# Altium schematic sheet VCO_BFP420.SchDoc: Voltage Controlled Oscillator
size A4; Author: Alemla; Revision: 1.2; SheetNumber: 3; SheetTotal: 7; SPICEModelCacheUMHTQHEF: <root> / <DocumentId>UMHTQHEF</DocumentId> / </root>
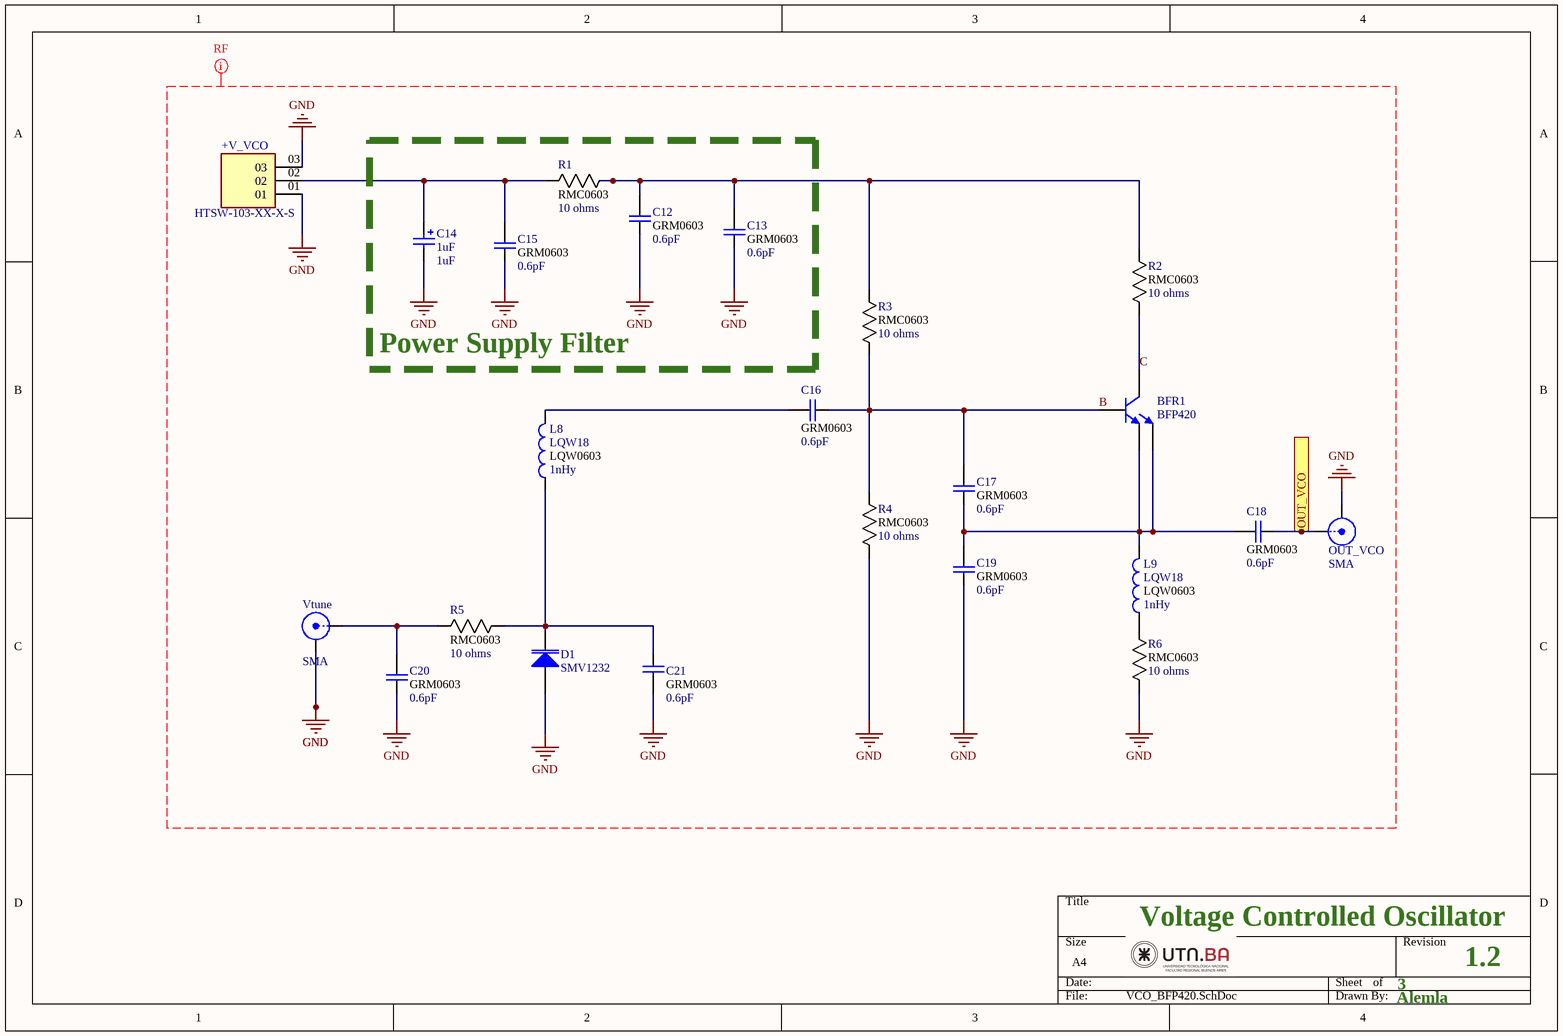
[diagram p0: VCO_BFP420.SchDoc]

## Parts
+V_VCO  HTSW-103-XX-X-S  [SAMTEC_HTSW-103-XX-X-S]
BFR1  BFP420  [SOT-343_N]
C12  value 0.6pF  footprint: GRM0603  [CAPC1608X90N]  (hidden comment: Cap 0603)
C13  value 0.6pF  footprint: GRM0603  [CAPC1608X90N]  (hidden comment: Cap 0603)
C14  1uF  [6-0805_N]
C15  value 0.6pF  footprint: GRM0603  [CAPC1608X90N]  (hidden comment: Cap 0603)
C16  value 0.6pF  footprint: GRM0603  [CAPC1608X90N]  (hidden comment: Cap 0603)
C17  value 0.6pF  footprint: GRM0603  [CAPC1608X90N]  (hidden comment: Cap 0603)
C18  value 0.6pF  footprint: GRM0603  [CAPC1608X90N]  (hidden comment: Cap 0603)
C19  value 0.6pF  footprint: GRM0603  [CAPC1608X90N]  (hidden comment: Cap 0603)
C20  value 0.6pF  footprint: GRM0603  [CAPC1608X90N]  (hidden comment: Cap 0603)
C21  value 0.6pF  footprint: GRM0603  [CAPC1608X90N]  (hidden comment: Cap 0603)
D1  SMV1232  [6-0805_N]
L8  LQW18  value 1nHy  Parameter 1: LQW0603  [INDC1608X100N]
L9  LQW18  value 1nHy  Parameter 1: LQW0603  [INDC1608X100N]
OUT_VCO  SMA  [SMA-142-0701-851]
R1  value 10 ohms  footprint: RMC0603  [RESC1508X55N]  (hidden comment: Resistor)
R2  value 10 ohms  footprint: RMC0603  [RESC1508X55N]  (hidden comment: Resistor)
R3  value 10 ohms  footprint: RMC0603  [RESC1508X55N]  (hidden comment: Resistor)
R4  value 10 ohms  footprint: RMC0603  [RESC1508X55N]  (hidden comment: Resistor)
R5  value 10 ohms  footprint: RMC0603  [RESC1508X55N]  (hidden comment: Resistor)
R6  value 10 ohms  footprint: RMC0603  [RESC1508X55N]  (hidden comment: Resistor)
Vtune  SMA  [SMA-142-0701-851]

## Ports
OUT_VCO (out)

## Nets
GND: +V_VCO.01 +V_VCO.03 C12.1 C13.1 C14.2 C15.1 C19.1 C20.1 C21.2 D1.1(A) OUT_VCO.2(Y) R4.1 R6.1 Vtune.2(Y)
B: BFR1.4(B) C16.1 C17.2 R3.1 R4.2
C: BFR1.2(C) R2.1
OUT_VCO: C18.1 OUT_VCO.1(X) ; port OUT_VCO
Net+V_VCO_02: +V_VCO.02 C14.1 C15.2 R1.1
NetBFR1_1: BFR1.1(E) BFR1.3(E) C17.1 C18.2 C19.2 L9.2
NetC12_2: C12.2 C13.2 R1.2 R2.2 R3.2
NetC16_2: C16.2 L8.2
NetC20_2: C20.2 R5.2 Vtune.1(X)
NetC21_1: C21.1 D1.2(K) L8.1 R5.1
NetL9_1: L9.1 R6.2

## Layout directives
net class RF50R: B, C, GND

## Notes on the sheet
- Power Supply Filter

## Library data of the parts
+V_VCO = HTSW-103-XX-X-S: Conn Unshrouded Header HDR 3 POS 2.54mm Solder ST Top Entry Thru-Hole Bag; MP: HTSW-103-08-S-S; MF: Samtec; SnapEDA_Link: https://www.snapeda.com/parts/HTSW-103-08-S-S/Samtec/view-part/?ref=snap; Purchase-URL: https://pricing.snapeda.com/search/part/HTSW-103-08-S-S/?ref=eda; Value: *; Availability: In Stock; Check_prices: https://www.snapeda.com/parts/HTSW-103-08-S-S/Samtec/view-part/?ref=eda; Package: None; Price: None
BFR1 = BFR460: NPN Bipolar Transistor; Published: 8-Jun-2000; LatestRevisionDate: 17-Jul-2002; LatestRevisionNote: Re-released for DXP Platform.; PackageReference: TO-226-AA; Publisher: Altium Limited; PackageDescription: TO, Flat Index; 3 In-Line, Axial Leads; Body Dia. 4.8mm; Leads 0.55 x 0.51 mm (max); Code_JEDEC: TO-226-AA
C12 C13 C15-C21 = Cap: Capacitor GRM18 0603; Published: 8-Jun-2000; LatestRevisionDate: 17-Jul-2002; LatestRevisionNote: Re-released for DXP Platform.; PackageReference: POLAR0.8; Publisher: Altium Limited; PackageDescription: Polarized Capacitor; 2 Leads; Supplier 1: Mouser
C14 = Cap Pol2_1: Polarized Capacitor (Axial); Published: 8-Jun-2000; LatestRevisionDate: 17-Jul-2002; LatestRevisionNote: Re-released for DXP Platform.; PackageReference: POLAR0.8; Publisher: Altium Limited; PackageDescription: Polarized Capacitor; 2 Leads; Value: 1uF
D1 = D Varactor: Variable Capacitance Diode; Note: Pin 2 is not connected and not drawn.; Published: 8-Jun-2000; LatestRevisionDate: 29-May-2009; LatestRevisionNote: IPC-7351 Footprint Added.; DatasheetVersion: Jan-1998; PackageVersion: 1996; PackageReference: SOT23A; Publisher: Altium Limited; PackageDescription: 3-Pin SOT-23 Package 0.95 mm Pitch, 2.3 mm Lead Span - Reverse Pinning; ComponentLink1Description: Manufacturer Link; ComponentLink1URL: http://www.zetex.com/
L8 L9 = LQW18: Ind RF Chip Wirewound 18nH 5% 100MHz 40Q-Factor 550mA 0603 Paper T/R; MP: LQW18AN18NJ00D; Package: None; Price: None; Availability: Unavailable
OUT_VCO Vtune = SMA: SMA Straight Connector; LatestRevisionDate: 17-Jul-2002; LatestRevisionNote: Re-released for DXP Platform.; Publisher: Altium Limited
R1-R6 = Resistor: Resistor RMC0603; Mfr_Name: Stackpole International